# EAGLE design untitled (EAGLE 4.16)
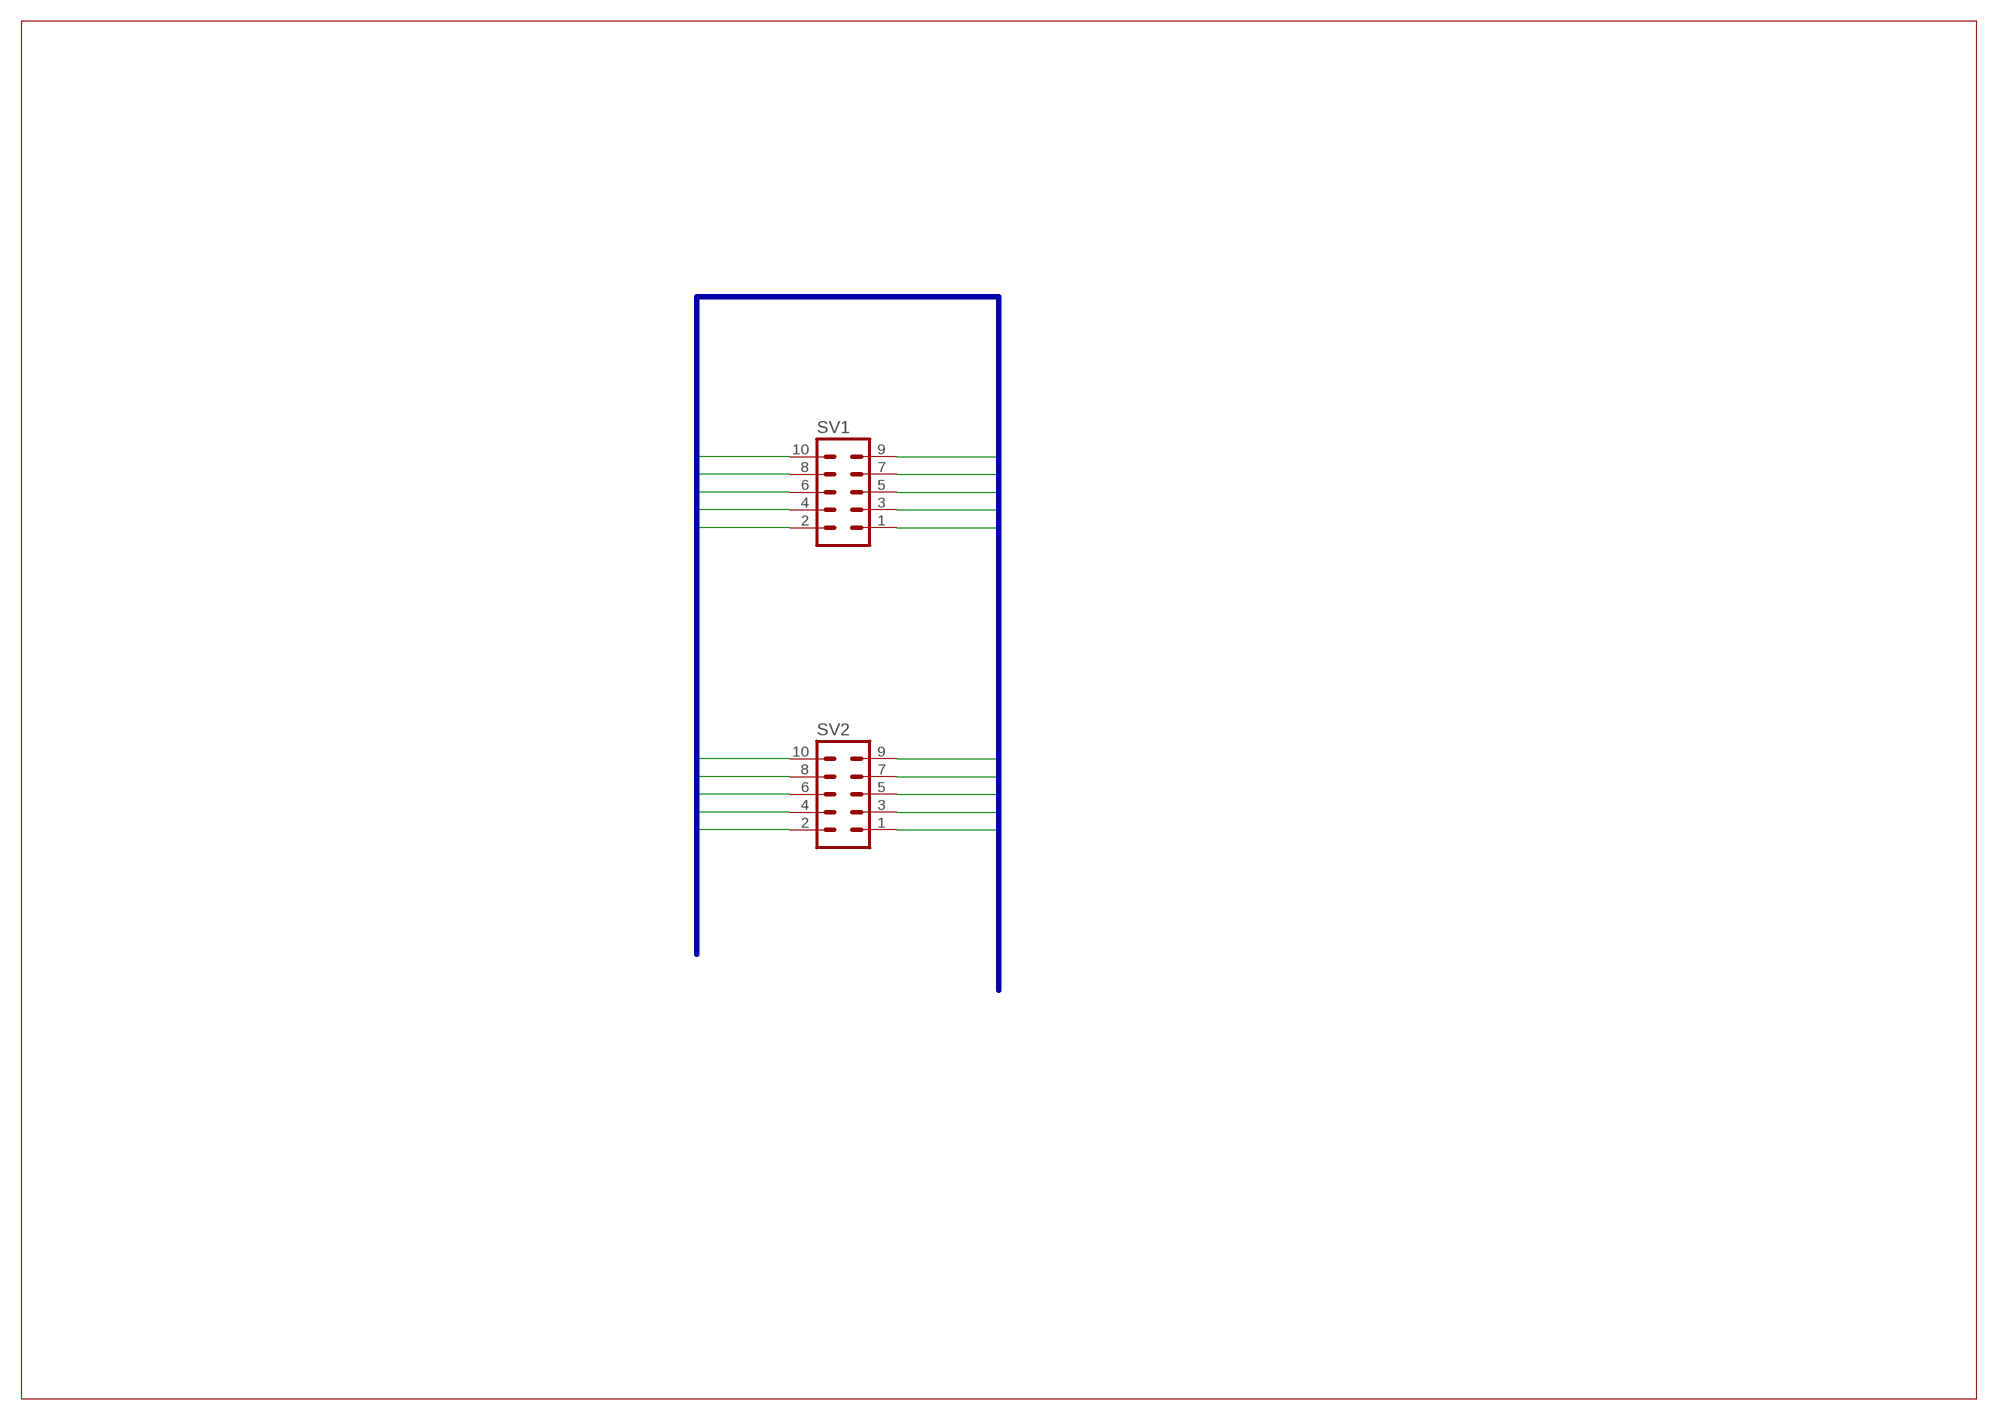
[diagram p0: schematic, sheet 1]

## Parts
SV1  MA05-2  [MA05-2]
SV2  MA05-2  [MA05-2]

## Nets
C1: SV1.1 SV2.1
C2: SV1.2 SV2.2
C3: SV1.3 SV2.3
C4: SV1.4 SV2.4
C5: SV1.5 SV2.5
C6: SV1.6 SV2.6
C7: SV1.7 SV2.7
C8: SV1.8 SV2.8
C9: SV1.9 SV2.9
C10: SV1.10 SV2.10

## Buses
C[1..10]

## Library data of the parts
SV1 SV2 = con-lstb:MA05-2: PIN HEADER

## Board
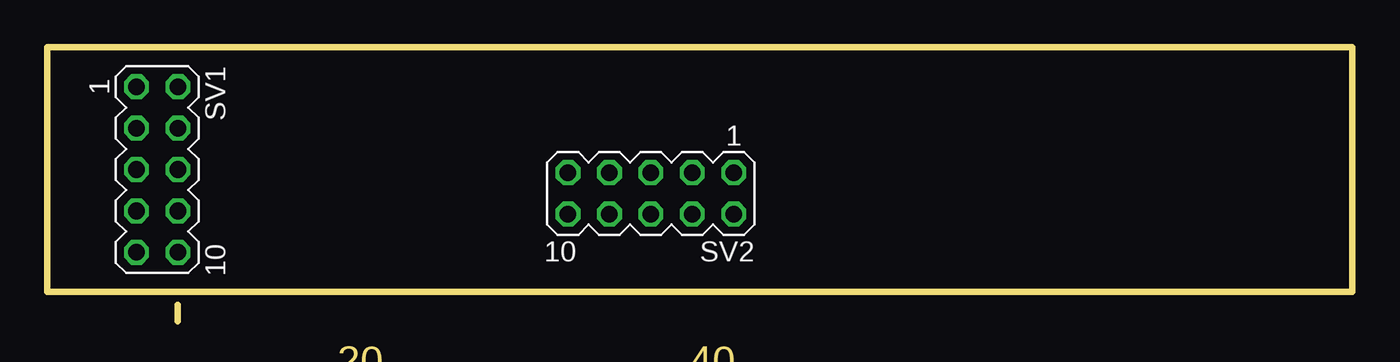
[diagram p1: board, top side]
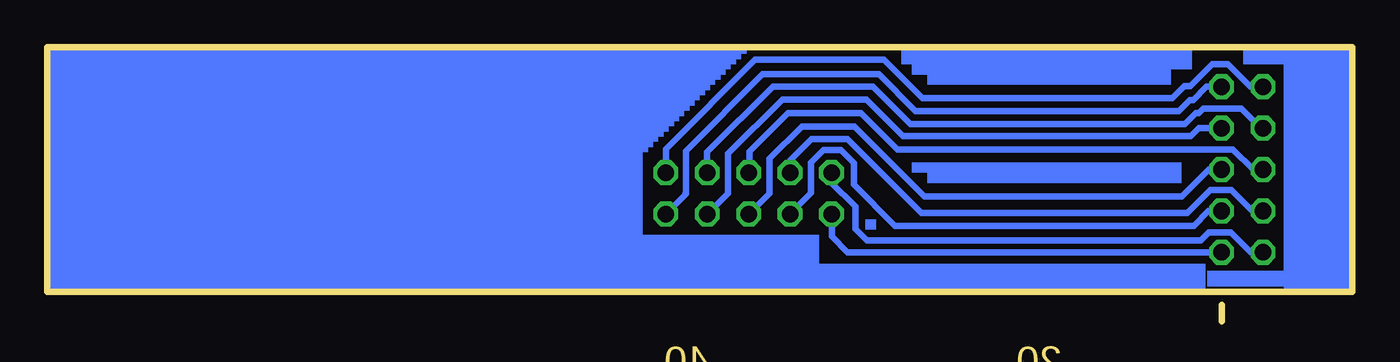
[diagram p2: board, bottom side, seen from below]

Size 80 x 16.8 mm. Coordinates in mm from the lower left corner, seen from the top.
Outline: 8,1 8,0
Outline: 0,1.8 80,1.8 80,16.8 0,16.8 0,1.8
Copper layers (1*16): Top 0.035mm / dielectric 1.5mm / Bottom 0.035mm
Design rules "default": minimum track width 10mil, minimum drill 24mil, track to track 8mil, track to pad 8mil, pad to pad 8mil, via to via 8mil, smd to smd 8mil, copper to edge 40mil, drill to drill 8mil, minimum pad ring 10mil, minimum via ring 8mil, stop-mask expansion 4mil, vias tented up to drill 0mil, thermal gap 10mil

### Footprints (pad centres in the part's own frame; a part is rotated, then mirrored left to right if it is on the bottom)
MA05-2 = drill 1.016 octagon: 1 -5.08,-1.27; 2 -5.08,1.27; 3 -2.54,-1.27; 4 -2.54,1.27; 5 0,-1.27; 6 0,1.27; 7 2.54,-1.27; 8 2.54,1.27; 9 5.08,-1.27; 10 5.08,1.27

### Placement (x,y rotation side)
SV1  6.73,9.3 270 top
SV2  37,7.84 180 top

### Tracks (layer width: path | path; a pad name or v marks a point on that pad's centre or on a via)
C1
  Bottom 0.406: SV1.1 6.23,14.38 7.62,15.77 8.58,15.77 9.93,14.42 10.28,14.42 11.02,13.68 26.34,13.68 28.71,16.05 36.6,16.05 42.08,10.57 42.08,9.34 42.16,9.26 42.08,9.18 SV2.1 42.08,9.16 42.07,9.17
C2
  Bottom 0.406: SV1.2 8.94,14.38 9.75,13.57 9.94,13.57 10.62,12.89 26.77,12.89 29.02,15.14 36.16,15.14 40.85,10.45 40.85,7.83 40.86,7.82 40.86,7.78 SV2.2
C3
  Bottom 0.406: SV1.3 5.59,11.84 6.79,13.04 9.12,13.04 9.4,12.76 9.59,12.76 10.25,12.1 27.07,12.1 29.37,14.4 35.52,14.4 39.55,10.37 SV2.3 | 39.52,9.11 39.48,9.07 | 39.52,9.11 SV2.3 | 39.52,9.11 39.54,9.13 | SV2.3 39.6,9.06
C4
  Bottom 0.406: SV1.4 9.41,11.84 9.88,11.37 27.55,11.37 29.78,13.6 34.93,13.6 38.26,10.27 38.26,7.82 39.51,6.57 SV2.4
C5
  Bottom 0.406: SV1.5 6.07,9.3 7.3,10.53 27.87,10.53 30.11,12.77 34.58,12.77 36.95,10.4 36.95,9.2 37,9.15 SV2.5
C6
  Bottom 0.406: SV1.6 8.79,9.3 10.45,7.64 26.22,7.64 30.52,11.94 33.74,11.94 35.71,9.97 35.71,7.84 36.98,6.57 SV2.6
C7
  Bottom 0.406: SV1.7 6.11,6.76 7.4,8.05 8.68,8.05 10.09,6.64 26.42,6.64 30.95,11.17 33.16,11.17 34.45,9.88 34.45,9.17 34.48,9.14 SV2.7
C8
  Bottom 0.406: SV1.8 8.81,6.76 9.72,5.85 28.03,5.85 30.56,8.38 30.56,9.71 31.34,10.49 32.41,10.49 33.17,9.73 33.17,7.86 SV2.8
C9
  Bottom 0.406: SV1.9 6.21,4.22 7.44,5.45 8.79,5.45 9.28,4.96 29.76,4.96 30.46,5.66 30.46,7.03 31.95,8.52 31.95,9.02 31.89,9.08 SV2.9
C10
  Bottom 0.406: SV1.10 30.93,4.22 31.89,5.18 31.89,6.56 31.88,6.57 | 31.87,6.58 31.88,6.57 | 31.88,6.57 SV2.10
N$1
  Bottom 0.406: 0,2.75 0,1.8 0.95,1.8
N$2
  Bottom 0.406: 0,15.77 0,16.72
N$3
  Bottom 0.406: 0,16.8 0.93,16.8
N$4
  Bottom 0.406: 79.17,16.8 80,16.8 80,16.16
N$5
  Bottom 0.406: 80,2.48 80,1.8 79.01,1.8
(copper drawn outside any net)
  shapes: Bottom area x34

### Text on the board
Dimension: 20 | 40
tOrigins: 37 | 6.73 | 7.5 | 6.04 | 3.5 | 80